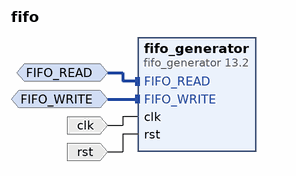
[diagram p0: block diagram of the top level]
# Vivado block design fifo, xc7z020clg400-1, Vivado 2023.2
create_bd_design fifo

create_bd_intf_port -mode Slave -vlnv xilinx.com:interface:fifo_read_rtl:1.0 FIFO_READ
create_bd_intf_port -mode Slave -vlnv xilinx.com:interface:fifo_write_rtl:1.0 FIFO_WRITE
create_bd_port -dir I -type clk clk
create_bd_port -dir I rst

create_bd_cell -type ip -vlnv xilinx.com:ip:fifo_generator:13.2 fifo_generator
set_property -dict [list \
  CONFIG.Fifo_Implementation Common_Clock_Builtin_FIFO \
  CONFIG.INTERFACE_TYPE Native \
  CONFIG.Input_Data_Width 8 \
  CONFIG.Input_Depth 512 \
] [get_bd_cells fifo_generator]

# ---- connections ----

connect_bd_intf_net -intf_net FIFO_READ_0_1 [get_bd_intf_ports FIFO_READ] [get_bd_intf_pins fifo_generator/FIFO_READ]
connect_bd_intf_net -intf_net FIFO_WRITE_0_1 [get_bd_intf_ports FIFO_WRITE] [get_bd_intf_pins fifo_generator/FIFO_WRITE]
connect_bd_net -net clk_0_1 [get_bd_ports clk] [get_bd_pins fifo_generator/clk]
connect_bd_net -net rst_0_1 [get_bd_ports rst] [get_bd_pins fifo_generator/rst]

validate_bd_design
save_bd_design
